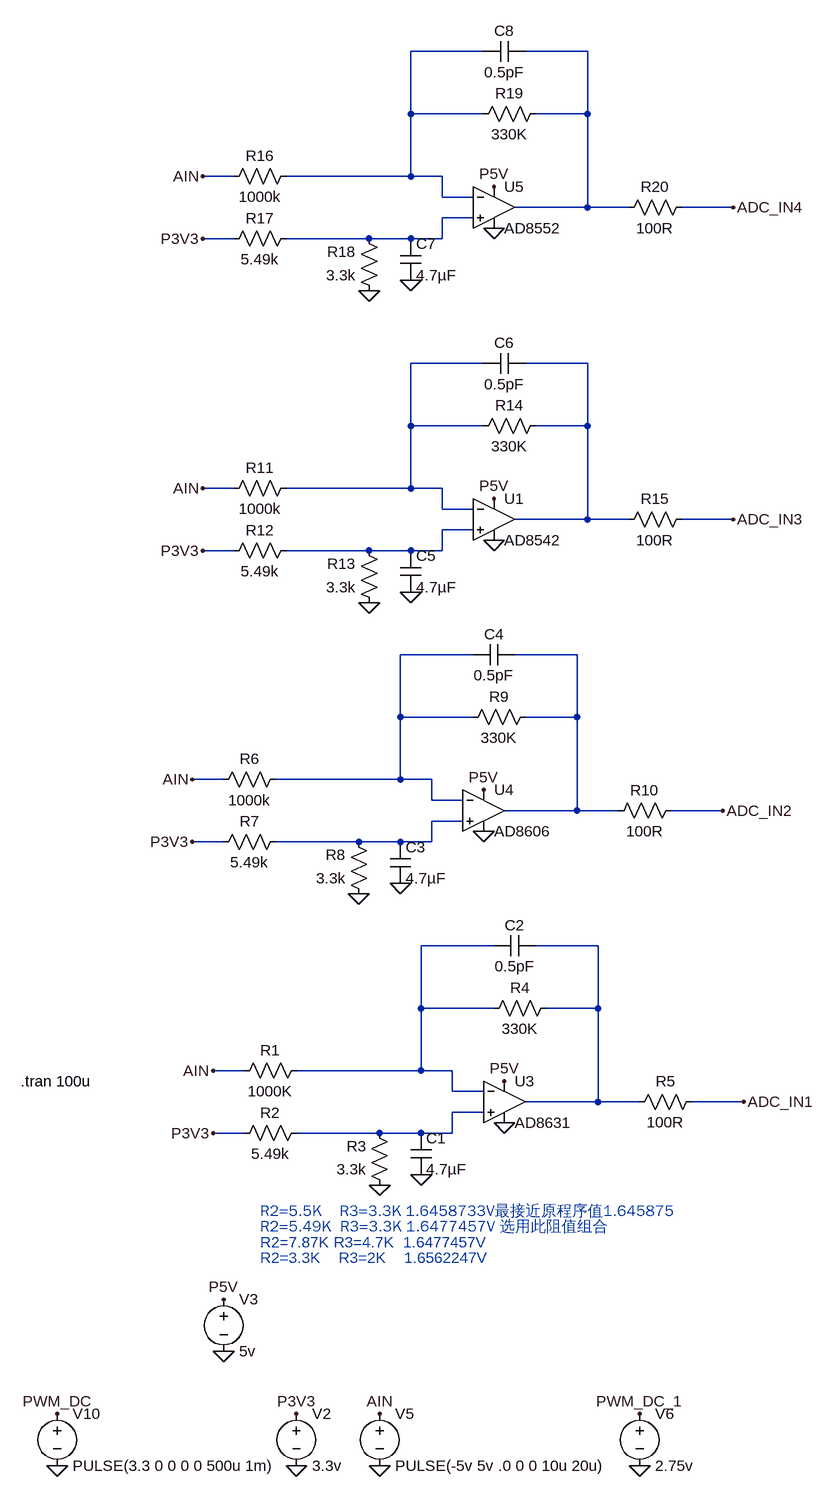
[diagram p0: schematic AD8551_分析_修改为3.3V.asc]
AD8551_分析_修改为3.3V.asc, the LTspice schematic file:
Version 4
SHEET 1 1680 1284
WIRE -624 -1632 -736 -1632
WIRE -464 -1632 -560 -1632
WIRE -736 -1536 -736 -1632
WIRE -624 -1536 -736 -1536
WIRE -464 -1536 -464 -1632
WIRE -464 -1536 -544 -1536
WIRE -1008 -1440 -1056 -1440
WIRE -736 -1440 -736 -1536
WIRE -736 -1440 -928 -1440
WIRE -688 -1440 -736 -1440
WIRE -688 -1408 -688 -1440
WIRE -640 -1408 -688 -1408
WIRE -464 -1392 -464 -1536
WIRE -464 -1392 -576 -1392
WIRE -400 -1392 -464 -1392
WIRE -240 -1392 -320 -1392
WIRE -640 -1376 -688 -1376
WIRE -1008 -1344 -1056 -1344
WIRE -800 -1344 -928 -1344
WIRE -736 -1344 -800 -1344
WIRE -688 -1344 -688 -1376
WIRE -688 -1344 -736 -1344
WIRE -624 -1152 -736 -1152
WIRE -464 -1152 -560 -1152
WIRE -736 -1056 -736 -1152
WIRE -624 -1056 -736 -1056
WIRE -464 -1056 -464 -1152
WIRE -464 -1056 -544 -1056
WIRE -1008 -960 -1056 -960
WIRE -736 -960 -736 -1056
WIRE -736 -960 -928 -960
WIRE -688 -960 -736 -960
WIRE -688 -928 -688 -960
WIRE -640 -928 -688 -928
WIRE -464 -912 -464 -1056
WIRE -464 -912 -576 -912
WIRE -400 -912 -464 -912
WIRE -240 -912 -320 -912
WIRE -640 -896 -688 -896
WIRE -1008 -864 -1056 -864
WIRE -800 -864 -928 -864
WIRE -736 -864 -800 -864
WIRE -688 -864 -688 -896
WIRE -688 -864 -736 -864
WIRE -640 -704 -752 -704
WIRE -480 -704 -576 -704
WIRE -752 -608 -752 -704
WIRE -640 -608 -752 -608
WIRE -480 -608 -480 -704
WIRE -480 -608 -560 -608
WIRE -1024 -512 -1072 -512
WIRE -752 -512 -752 -608
WIRE -752 -512 -944 -512
WIRE -704 -512 -752 -512
WIRE -704 -480 -704 -512
WIRE -656 -480 -704 -480
WIRE -480 -464 -480 -608
WIRE -480 -464 -592 -464
WIRE -416 -464 -480 -464
WIRE -256 -464 -336 -464
WIRE -656 -448 -704 -448
WIRE -1024 -416 -1072 -416
WIRE -816 -416 -944 -416
WIRE -752 -416 -816 -416
WIRE -704 -416 -704 -448
WIRE -704 -416 -752 -416
WIRE -608 -256 -720 -256
WIRE -448 -256 -544 -256
WIRE -720 -160 -720 -256
WIRE -608 -160 -720 -160
WIRE -448 -160 -448 -256
WIRE -448 -160 -528 -160
WIRE -992 -64 -1040 -64
WIRE -720 -64 -720 -160
WIRE -720 -64 -912 -64
WIRE -672 -64 -720 -64
WIRE -672 -32 -672 -64
WIRE -624 -32 -672 -32
WIRE -448 -16 -448 -160
WIRE -448 -16 -560 -16
WIRE -384 -16 -448 -16
WIRE -224 -16 -304 -16
WIRE -624 0 -672 0
WIRE -992 32 -1040 32
WIRE -784 32 -912 32
WIRE -720 32 -784 32
WIRE -672 32 -672 0
WIRE -672 32 -720 32
FLAG -912 544 0
FLAG -1024 368 0
FLAG -784 544 0
FLAG -1024 288 P5V
FLAG -1280 544 0
FLAG -1280 464 PWM_DC
FLAG -912 464 P3V3
FLAG -384 544 0
FLAG -384 464 PWM_DC_1
FLAG -224 -16 ADC_IN1
FLAG -1040 32 P3V3
FLAG -592 -48 P5V
FLAG -592 16 0
FLAG -784 112 0
FLAG -720 96 0
FLAG -784 464 AIN
FLAG -1040 -64 AIN
FLAG -1072 -416 P3V3
FLAG -624 -496 P5V
FLAG -624 -432 0
FLAG -816 -336 0
FLAG -752 -352 0
FLAG -1072 -512 AIN
FLAG -256 -464 ADC_IN2
FLAG -1056 -864 P3V3
FLAG -608 -944 P5V
FLAG -608 -880 0
FLAG -800 -784 0
FLAG -736 -800 0
FLAG -1056 -960 AIN
FLAG -240 -912 ADC_IN3
FLAG -1056 -1344 P3V3
FLAG -608 -1424 P5V
FLAG -608 -1360 0
FLAG -800 -1264 0
FLAG -736 -1280 0
FLAG -1056 -1440 AIN
FLAG -240 -1392 ADC_IN4
SYMBOL voltage -912 448 R0
WINDOW 123 0 0 Left 0
WINDOW 39 0 0 Left 0
SYMATTR InstName V2
SYMATTR Value 3.3v
SYMBOL voltage -1024 272 R0
WINDOW 123 0 0 Left 0
WINDOW 39 0 0 Left 0
SYMATTR InstName V3
SYMATTR Value 5v
SYMBOL voltage -784 448 R0
WINDOW 123 0 0 Left 0
WINDOW 39 0 0 Left 0
SYMATTR InstName V5
SYMATTR Value PULSE(-5v 5v .0 0 0 10u 20u)
SYMBOL voltage -1280 448 R0
WINDOW 123 0 0 Left 0
WINDOW 39 0 0 Left 0
SYMATTR InstName V10
SYMATTR Value PULSE(3.3 0 0 0 0 500u 1m)
SYMBOL voltage -384 448 R0
WINDOW 123 0 0 Left 0
WINDOW 39 0 0 Left 0
SYMATTR InstName V6
SYMATTR Value 2.75v
SYMBOL res -896 -80 R90
WINDOW 0 0 56 VBottom 2
WINDOW 3 32 56 VTop 2
SYMATTR InstName R1
SYMATTR Value 1000K
SYMBOL res -896 16 R90
WINDOW 0 0 56 VBottom 2
WINDOW 3 32 56 VTop 2
SYMATTR InstName R2
SYMATTR Value 5.49k
SYMBOL res -768 128 R180
WINDOW 0 36 76 Left 2
WINDOW 3 36 40 Left 2
SYMATTR InstName R3
SYMATTR Value 3.3k
SYMBOL res -624 -144 R270
WINDOW 0 32 56 VTop 2
WINDOW 3 0 56 VBottom 2
SYMATTR InstName R4
SYMATTR Value 330K
SYMBOL res -400 0 R270
WINDOW 0 32 56 VTop 2
WINDOW 3 0 56 VBottom 2
SYMATTR InstName R5
SYMATTR Value 100R
SYMBOL cap -736 32 R0
SYMATTR InstName C1
SYMATTR Value 4.7µF
SYMBOL cap -544 -272 R90
WINDOW 0 0 32 VBottom 2
WINDOW 3 32 32 VTop 2
SYMATTR InstName C2
SYMATTR Value 0.5pF
SYMBOL res -928 -528 R90
WINDOW 0 0 56 VBottom 2
WINDOW 3 32 56 VTop 2
SYMATTR InstName R6
SYMATTR Value 1000k
SYMBOL res -928 -432 R90
WINDOW 0 0 56 VBottom 2
WINDOW 3 32 56 VTop 2
SYMATTR InstName R7
SYMATTR Value 5.49k
SYMBOL res -800 -320 R180
WINDOW 0 36 76 Left 2
WINDOW 3 36 40 Left 2
SYMATTR InstName R8
SYMATTR Value 3.3k
SYMBOL res -656 -592 R270
WINDOW 0 32 56 VTop 2
WINDOW 3 0 56 VBottom 2
SYMATTR InstName R9
SYMATTR Value 330K
SYMBOL res -432 -448 R270
WINDOW 0 32 56 VTop 2
WINDOW 3 0 56 VBottom 2
SYMATTR InstName R10
SYMATTR Value 100R
SYMBOL cap -768 -416 R0
SYMATTR InstName C3
SYMATTR Value 4.7µF
SYMBOL cap -576 -720 R90
WINDOW 0 0 32 VBottom 2
WINDOW 3 32 32 VTop 2
SYMATTR InstName C4
SYMATTR Value 0.5pF
SYMBOL res -912 -976 R90
WINDOW 0 0 56 VBottom 2
WINDOW 3 32 56 VTop 2
SYMATTR InstName R11
SYMATTR Value 1000k
SYMBOL res -912 -880 R90
WINDOW 0 0 56 VBottom 2
WINDOW 3 32 56 VTop 2
SYMATTR InstName R12
SYMATTR Value 5.49k
SYMBOL res -784 -768 R180
WINDOW 0 36 76 Left 2
WINDOW 3 36 40 Left 2
SYMATTR InstName R13
SYMATTR Value 3.3k
SYMBOL res -640 -1040 R270
WINDOW 0 32 56 VTop 2
WINDOW 3 0 56 VBottom 2
SYMATTR InstName R14
SYMATTR Value 330K
SYMBOL res -416 -896 R270
WINDOW 0 32 56 VTop 2
WINDOW 3 0 56 VBottom 2
SYMATTR InstName R15
SYMATTR Value 100R
SYMBOL cap -752 -864 R0
SYMATTR InstName C5
SYMATTR Value 4.7µF
SYMBOL cap -560 -1168 R90
WINDOW 0 0 32 VBottom 2
WINDOW 3 32 32 VTop 2
SYMATTR InstName C6
SYMATTR Value 0.5pF
SYMBOL OpAmps\\AD8606 -624 -528 R0
SYMATTR InstName U4
SYMBOL AutoGenerated\\AD8631 -592 -16 R0
SYMATTR InstName U3
SYMBOL OpAmps\\AD8542 -608 -976 R0
SYMATTR InstName U1
SYMBOL res -912 -1456 R90
WINDOW 0 0 56 VBottom 2
WINDOW 3 32 56 VTop 2
SYMATTR InstName R16
SYMATTR Value 1000k
SYMBOL res -912 -1360 R90
WINDOW 0 0 56 VBottom 2
WINDOW 3 32 56 VTop 2
SYMATTR InstName R17
SYMATTR Value 5.49k
SYMBOL res -784 -1248 R180
WINDOW 0 36 76 Left 2
WINDOW 3 36 40 Left 2
SYMATTR InstName R18
SYMATTR Value 3.3k
SYMBOL res -640 -1520 R270
WINDOW 0 32 56 VTop 2
WINDOW 3 0 56 VBottom 2
SYMATTR InstName R19
SYMATTR Value 330K
SYMBOL res -416 -1376 R270
WINDOW 0 32 56 VTop 2
WINDOW 3 0 56 VBottom 2
SYMATTR InstName R20
SYMATTR Value 100R
SYMBOL cap -752 -1344 R0
SYMATTR InstName C7
SYMATTR Value 4.7µF
SYMBOL cap -560 -1648 R90
WINDOW 0 0 32 VBottom 2
WINDOW 3 32 32 VTop 2
SYMATTR InstName C8
SYMATTR Value 0.5pF
SYMBOL OpAmps\\AD8552 -608 -1456 R0
SYMATTR InstName U5
TEXT -1336 -48 Left 2 !.tran 100u
TEXT -968 152 Left 2 ;R2=5.5K    R3=3.3K 1.6458733V最接近原程序值1.645875
TEXT -968 200 Left 2 ;R2=7.87K R3=4.7K  1.6477457V
TEXT -968 224 Left 2 ;R2=3.3K    R3=2K    1.6562247V
TEXT -968 176 Left 2 ;R2=5.49K  R3=3.3K 1.6477457V 选用此阻值组合

The netlist it stands for:
* AD8551_分析_修改为3.3V.asc
V2 P3V3 0 3.3v
V3 P5V 0 5v
V5 AIN 0 PULSE(-5v 5v .0 0 0 10u 20u)
V10 PWM_DC 0 PULSE(3.3 0 0 0 0 500u 1m)
V6 PWM_DC_1 0 2.75v
R1 N010 AIN 1000K
R2 N012 P3V3 5.49k
R3 0 N012 3.3k
R4 N010 N011 330K
R5 N011 ADC_IN1 100R
C1 N012 0 4.7µF
C2 N011 N010 0.5pF
R6 N007 AIN 1000k
R7 N009 P3V3 5.49k
R8 0 N009 3.3k
R9 N007 N008 330K
R10 N008 ADC_IN2 100R
C3 N009 0 4.7µF
C4 N008 N007 0.5pF
R11 N004 AIN 1000k
R12 N006 P3V3 5.49k
R13 0 N006 3.3k
R14 N004 N005 330K
R15 N005 ADC_IN3 100R
C5 N006 0 4.7µF
C6 N005 N004 0.5pF
XU4 N009 N007 P5V 0 N008 AD8606  ; pins In+ In- V+ V- OUT
* U3: AD8631 (symbol AutoGenerated\AD8631 not available, pins judged from their places): In+=N012 In-=N010 V+=P5V V-=0 OUT=N011
XU1 N006 N004 P5V 0 N005 AD8542  ; pins In+ In- V+ V- OUT
R16 N001 AIN 1000k
R17 N003 P3V3 5.49k
R18 0 N003 3.3k
R19 N001 N002 330K
R20 N002 ADC_IN4 100R
C7 N003 0 4.7µF
C8 N002 N001 0.5pF
XU5 N003 N001 P5V 0 N002 AD8552  ; pins In+ In- V+ V- OUT
.tran 100u
* R2=5.5K    R3=3.3K 1.6458733V最接近原程序值1.645875
* R2=7.87K R3=4.7K  1.6477457V
* R2=3.3K    R3=2K    1.6562247V
* R2=5.49K  R3=3.3K 1.6477457V 选用此阻值组合
.lib ADI.lib
.lib AD8542.sub
.backanno
.end